# Altium schematic sheet ELoad Control Assembly Gen 2 - Net Classes.SchDoc
size C
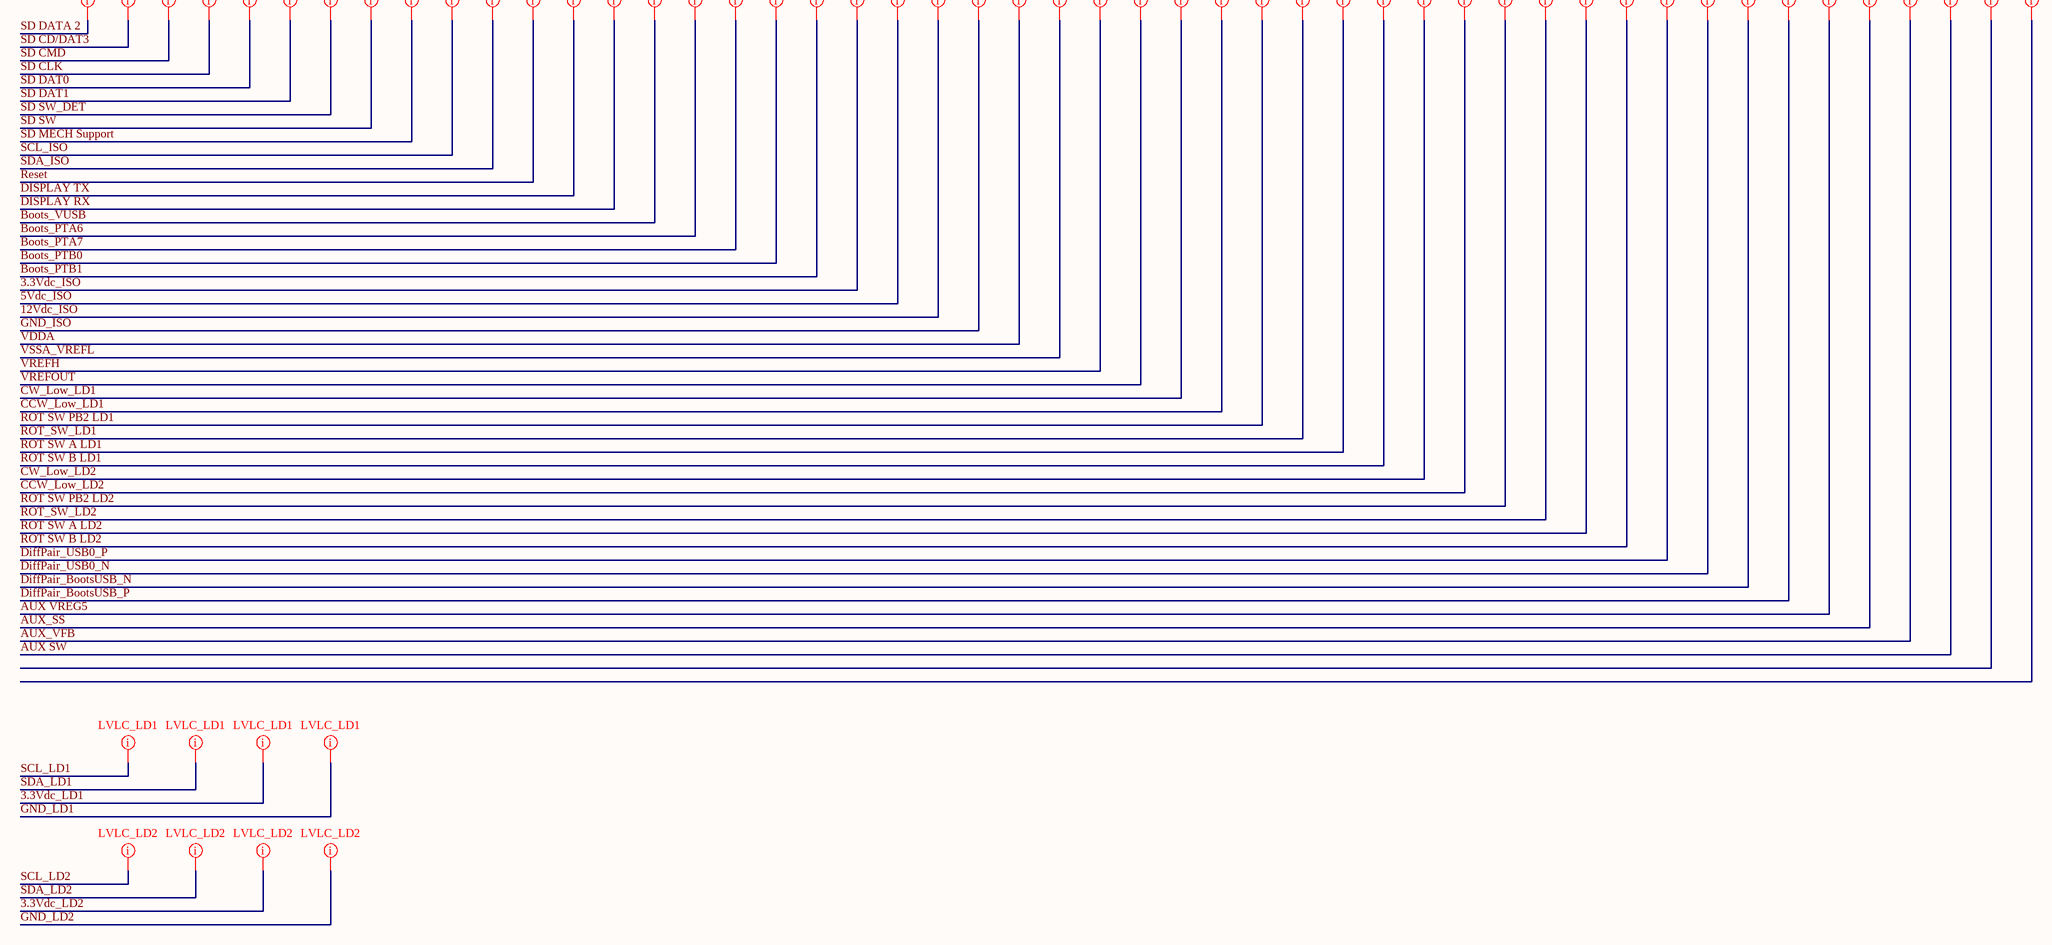
[diagram p0: ELoad Control Assembly Gen 2 - Net Classes.SchDoc]

## Layout directives
net class Low Volt; net class Low Current: 3.3Vdc_ISO, 5Vdc_ISO, 12Vdc_ISO, (no net found under the mark), AUX SW, AUX VREG5, AUX_SS, AUX_VFB, Boots_PTA6, Boots_PTA7, Boots_PTB0, Boots_PTB1, Boots_VUSB, CCW_Low_LD1, CCW_Low_LD2, CW_Low_LD1, CW_Low_LD2, DISPLAY RX, DISPLAY TX, GND_ISO, Reset, ROT SW A LD1, ROT SW A LD2, ROT SW B LD1, ROT SW B LD2, ROT SW PB2 LD1, ROT SW PB2 LD2, ROT_SW_LD1, ROT_SW_LD2, SCL_ISO, SD CD/DAT3, SD CLK, SD CMD, SD DAT0, SD DAT1, SD DATA 2, SD MECH Support, SD SW, SD SW_DET, SDA_ISO, VDDA, VREFH, VREFOUT, VSSA_VREFL
net class Low Volt; net class Low Current; net class HS_DiffPair: DiffPair_BootsUSB_N, DiffPair_BootsUSB_P, DiffPair_USB0_N, DiffPair_USB0_P
net class Low Volt LD1; net class Low Current: 3.3Vdc_LD1, GND_LD1, SCL_LD1, SDA_LD1
net class Low Volt LD2; net class Low Current: 3.3Vdc_LD2, GND_LD2, SCL_LD2, SDA_LD2